# EAGLE design NOR gate (EAGLE 6.1)
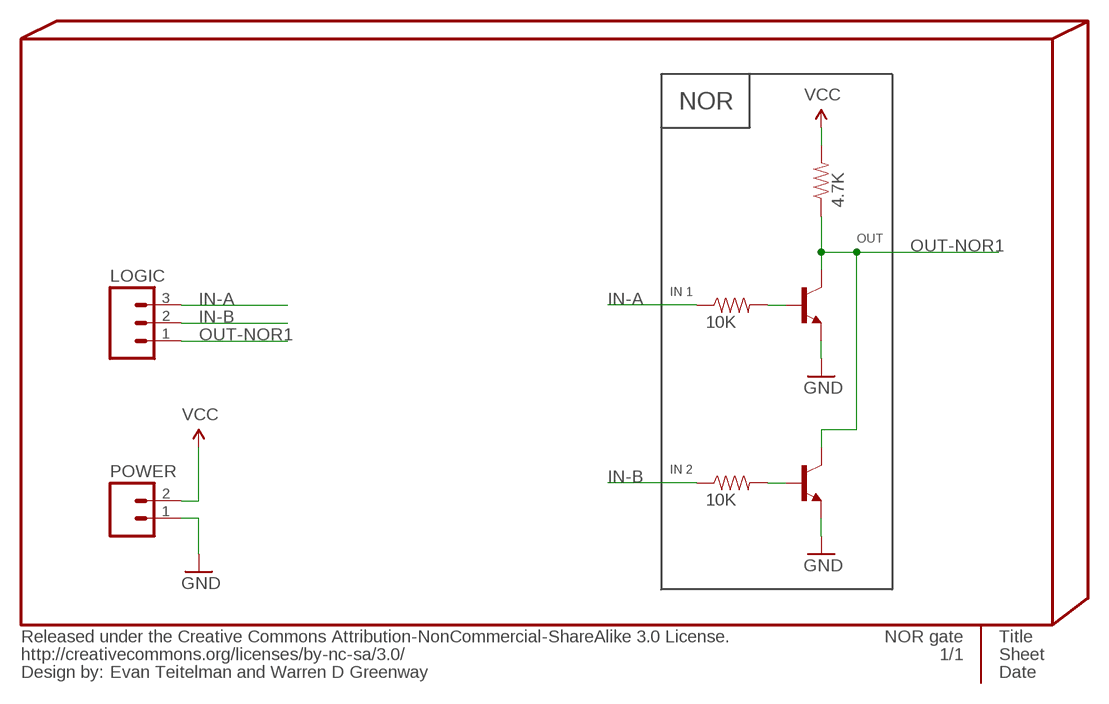
[diagram p0: schematic, sheet 1]

## Parts
INFO4  Evan Teitelman and Warren D Greenway  %CC-NC-SA  [%CC-NC-SA]
LOGIC  M03PTH  [1X03]
POWER  M02PTH  [1X02]
PUR-NOR1  4.7K  RESISTOR0402-RES  [0402-RES]
Q1-NOR1  TRANSISTOR_NPNSOT23  [SOT23]
Q2-NOR1  TRANSISTOR_NPNSOT23  [SOT23]
R1-NOR1  10K  RESISTOR0402-RES  [0402-RES]
R2-NOR1  10K  RESISTOR0402-RES  [0402-RES]

## Nets
GND: POWER.1 Q1-NOR1.2(E) Q2-NOR1.2(E) ; supply symbol labelled @GND
IN-A: LOGIC.3 R1-NOR1.1
IN-B: LOGIC.2 R2-NOR1.1
N$3: Q1-NOR1.1(B) R1-NOR1.2
N$4: Q2-NOR1.1(B) R2-NOR1.2
OUT-NOR1: LOGIC.1 PUR-NOR1.1 Q1-NOR1.3(C) Q2-NOR1.3(C)
VCC: POWER.2 PUR-NOR1.2 ; supply symbol labelled @VCC

## Notes on the sheet
- NOR
- OUT
- IN 1
- IN 2

## Library data of the parts
INFO4 = PygmyBoards:%CC-NC-SA: Released under the Creative Commons Attribution-NonCommercial-ShareAlike 3.0 License. http://creativecommons.org/licenses/by-sa/3.0 Design by: [Designer Name] Change this part's value to change the designer name
LOGIC = SparkFun:M03: Header 3 Standard 3-pin 0.1" header. Use with straight break away headers (SKU : PRT-00116), right angle break away headers (PRT-00553), swiss pins (PRT-00743), machine pins (PRT-00117), and female headers (PRT-00115). Molex polarized connector foot print use with SKU : PRT-08232 with associated crimp pins and housings.
POWER = SparkFun:M02: Header 2 Standard 2-pin 0.1" header. Use with straight break away headers (SKU : PRT-00116), right angle break away headers (PRT-00553), swiss pins (PRT-00743), machine pins (PRT-00117), and female headers (PRT-00115). Molex polarized connector foot print use with SKU : PRT-08233 with associated crimp pins and housings.
PUR-NOR1 R1-NOR1 R2-NOR1 = SparkFun:RESISTOR: Resistor Basic schematic elements and footprints for 0603, 1206, and PTH resistors.
Q1-NOR1 Q2-NOR1 = SparkFun:TRANSISTOR_NPN: Transistor NPN BJT configuration in SOT23 package. MMBT2222 is the common NPN we use. Double check BCE configuration again layout.

## Board
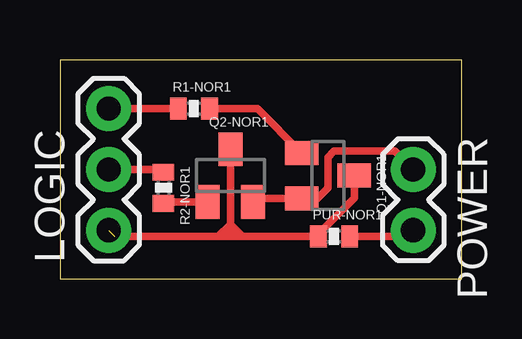
[diagram p1: board, top side]

Size 16.76 x 9.14 mm. Coordinates in mm from the lower left corner, seen from the top.
Outline: 0,0 16.76,0 16.76,9.14 0,9.14 0,0
Copper layers (1*16): Top 0.035mm / dielectric 1.5mm / Bottom 0.035mm
Design rules: minimum track width 6mil, minimum drill 13mil, track to track 6mil, track to pad 6mil, pad to pad 4mil, via to via 6mil, smd to smd 4mil, copper to edge 15mil, drill to drill 6mil, minimum pad ring 10mil, minimum via ring 8mil, stop-mask expansion 4mil, vias tented up to drill 25mil, thermal gap 10mil

### Footprints (pad centres in the part's own frame; a part is rotated, then mirrored left to right if it is on the bottom)
1X03 = drill 1.016 pad 1.88: 1 0,0; 2 2.54,0; 3 5.08,0
1X02 = drill 1.016 pad 1.88: 1 0,0; 2 2.54,0
0402-RES = smd 0.7 x 0.9: 1 -0.65,0; 2 0.65,0
SOT23 = smd 1 x 1.4: 1 -0.95,-1.1; 2 0.95,-1.1; 3 0,1.1

### Placement (x,y rotation side)
INFO4  0,-7.62 0 top  (outside the outline)
LOGIC  2.03,2.03 90 top
POWER  14.73,4.57 270 top
PUR-NOR1  11.43,1.78 0 top
Q1-NOR1  11.18,4.32 270 top
Q2-NOR1  7.11,4.32 0 top
R1-NOR1  5.59,7.11 0 top
R2-NOR1  4.32,3.81 270 top

### Tracks (layer width: path | path; a pad name or v marks a point on that pad's centre or on a via)
GND
  Top 0.305: Q2-NOR1.2 8.21,3.37 Q1-NOR1.2 10.73,3.37 11.18,3.81 11.18,5.08 11.43,5.33 13.97,5.33 POWER.1
IN-A
  Top 0.305: LOGIC.3 R1-NOR1.1
IN-B
  Top 0.305: R2-NOR1.1 4.21,4.57 LOGIC.2
N$3
  Top 0.305: Q1-NOR1.1 8.23,7.11 R1-NOR1.2
N$4
  Top 0.305: R2-NOR1.2 4.38,3.22 Q2-NOR1.1
OUT-NOR1  (1 unrouted)
  Top 0.305: Q1-NOR1.3 12.28,3.39 10.78,1.89 PUR-NOR1.1 7.62,1.78 | 2.29,1.78 6.6,1.78 | 6.6,1.78 7.11,1.78 | 7.11,1.78 7.62,1.78 | 7.11,1.78 7.11,2.29 | 7.11,2.29 Q2-NOR1.3 | 6.6,1.78 7.11,2.29 | 7.11,2.29 7.62,1.78
VCC
  Top 0.305: PUR-NOR1.2 14.48,1.78 POWER.2

### Text on the board
_bsilk: AND | Out | In-B | Gnd | In-A | Vcc